# EAGLE design M302 (EAGLE 6.6.0)
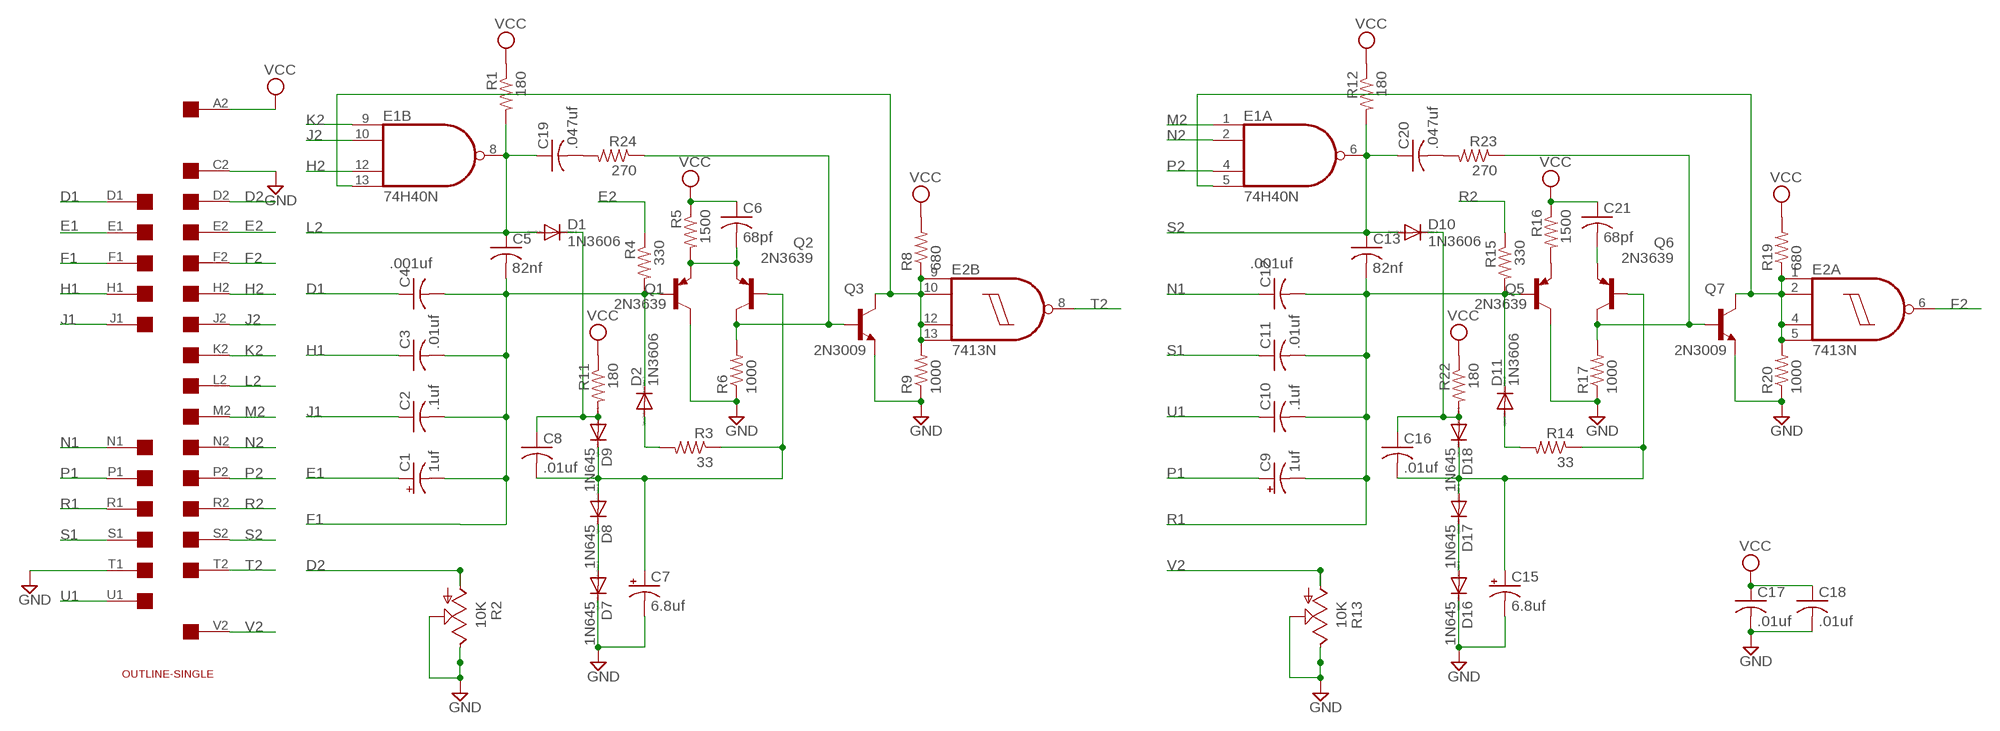
[diagram p0: schematic, sheet 1]

## Parts
C1  1uf  CPOL-USE15-5AXIAL  [E15-5]
C2  .1uf  C-US050-025X075  [C050-025X075]
C3  .01uf  C-US050-025X075  [C050-025X075]
C4  .001uf  C-US050-025X075  [C050-025X075]
C5  82nf  C-US050-025X075  [C050-025X075]
C6  68pf  C-US050-025X075  [C050-025X075]
C7  6.8uf  CPOL-USE15-5AXIAL  [E15-5]
C8  .01uf  C-US050-025X075  [C050-025X075]
C9  1uf  CPOL-USE15-5AXIAL  [E15-5]
C10  .1uf  C-US050-025X075  [C050-025X075]
C11  .01uf  C-US050-025X075  [C050-025X075]
C12  .001uf  C-US050-025X075  [C050-025X075]
C13  82nf  C-US050-025X075  [C050-025X075]
C15  6.8uf  CPOL-USE15-5AXIAL  [E15-5]
C16  .01uf  C-US050-025X075  [C050-025X075]
C17  .01uf  C-US050-025X075  [C050-025X075]
C18  .01uf  C-US050-025X075  [C050-025X075]
C19  .047uf  C-US050-025X075  [C050-025X075]
C20  .047uf  C-US050-025X075  [C050-025X075]
C21  68pf  C-US050-025X075  [C050-025X075]
D1  1N3606  1N4148DO35-10  [DO35-10]
D2  1N3606  1N4148DO35-10  [DO35-10]
D7  1N645  1N4148DO35-10  [DO35-10]
D8  1N645  1N4148DO35-10  [DO35-10]
D9  1N645  1N4148DO35-10  [DO35-10]
D10  1N3606  1N4148DO35-10  [DO35-10]
D11  1N3606  1N4148DO35-10  [DO35-10]
D16  1N645  1N4148DO35-10  [DO35-10]
D17  1N645  1N4148DO35-10  [DO35-10]
D18  1N645  1N4148DO35-10  [DO35-10]
E1  74H40N  74S20N  [DIL14]
E2  7413N  [DIL14]
Q1  2N3639  2N3637-PNP-TO39-EBC  [TO39]
Q2  2N3639  2N3637-PNP-TO39-EBC  [TO39]
Q3  2N3009  2N3019-NPN-TO39-EBC  [TO39]
Q5  2N3639  2N3637-PNP-TO39-EBC  [TO39]
Q6  2N3639  2N3637-PNP-TO39-EBC  [TO39]
Q7  2N3009  2N3019-NPN-TO39-EBC  [TO39]
R1  180  R-US_0207/10  [0207/10]
R2  10K  TRIM_US-PTSPIN  [PT-SPIN]
R3  33  R-US_0207/10  [0207/10]
R4  330  R-US_0207/10  [0207/10]
R5  1500  R-US_0207/10  [0207/10]
R6  1000  R-US_0207/10  [0207/10]
R8  680  R-US_0207/10  [0207/10]
R9  1000  R-US_0207/10  [0207/10]
R11  180  R-US_0207/10  [0207/10]
R12  180  R-US_0207/10  [0207/10]
R13  10K  TRIM_US-PTSPIN  [PT-SPIN]
R14  33  R-US_0207/10  [0207/10]
R15  330  R-US_0207/10  [0207/10]
R16  1500  R-US_0207/10  [0207/10]
R17  1000  R-US_0207/10  [0207/10]
R19  680  R-US_0207/10  [0207/10]
R20  1000  R-US_0207/10  [0207/10]
R22  180  R-US_0207/10  [0207/10]
R23  270  R-US_0207/10  [0207/10]
R24  270  R-US_0207/10  [0207/10]
U$1  SINGLE  [EDGE-CON2]
U$2  OUTLINE-SINGLE  [SINGLE]

## Nets
D1: C4.1 U$1.D1
D2: R2.A U$1.D2
E1: C1.+ U$1.E1
E2: R4.1 U$1.E2
F1: C1.- C2.2 C3.2 C4.2 C5.2 D2.C Q1.2(B) R4.2 U$1.F1
F2: E2.6(A:O) U$1.F2
GND [power]: C7.- C15.- C17.2 C18.2 D7.C D16.C Q1.3(C) Q3.1(E) Q5.3(C) Q7.1(E) R2.E R2.S R6.1 R9.1 R13.E R13.S R17.1 R20.1 U$1.C2 U$1.T1
H1: C3.1 U$1.H1
H2: E1.12(B:I2) U$1.H2
J1: C2.1 U$1.J1
J2: E1.10(B:I1) U$1.J2
K2: E1.9(B:I0) U$1.K2
L2: C5.1 C19.1 D1.A E1.8(B:O) R1.2 U$1.L2
M2: E1.1(A:I0) U$1.M2
N1: C12.1 U$1.N1
N2: E1.2(A:I1) U$1.N2
N$1: C8.1 D1.C D9.A R11.2
N$2: E1.13(B:I3) E2.9(B:I0) E2.10(B:I1) E2.12(B:I2) E2.13(B:I3) Q3.3(C) R8.1 R9.2
N$3: C6.2 Q1.1(E) Q2.1(E) R5.2
N$4: E1.5(A:I3) E2.1(A:I0) E2.2(A:I1) E2.4(A:I2) E2.5(A:I3) Q7.3(C) R19.1 R20.2
N$5: C7.+ C8.2 D8.A D9.C Q2.2(B) R3.1
N$6: Q6.3(C) Q7.2(B) R17.2 R23.1
N$7: D2.A R3.2
N$8: Q2.3(C) Q3.2(B) R6.2 R24.1
N$9: D7.A D8.C
N$10: Q5.1(E) R16.2
N$11: C21.2 Q6.1(E)
N$12: C15.+ C16.2 D17.A D18.C Q6.2(B) R14.1
N$13: D11.A R14.2
N$14: C19.2 R24.2
N$15: C20.2 R23.2
N$16: C16.1 D10.C D18.A R22.2
N$20: D16.A D17.C
P1: C9.+ U$1.P1
P2: E1.4(A:I2) U$1.P2
R1: C9.- C10.2 C11.2 C12.2 C13.2 D11.C Q5.2(B) R15.2 U$1.R1
R2: R15.1 U$1.R2
S1: C11.1 U$1.S1
S2: C13.1 C20.1 D10.A E1.6(A:O) R12.2 U$1.S2
T2: E2.8(B:O) U$1.T2
U1: C10.1 U$1.U1
V2: R13.A U$1.V2
VCC [power]: C6.1 C17.1 C18.1 C21.1 R1.1 R5.1 R8.2 R11.1 R12.1 R16.1 R19.2 R22.1 U$1.A2
Unconnected: U$1.A1 U$1.B1 U$1.B2 U$1.C1 U$1.K1 U$1.L1 U$1.M1 U$1.U2 U$1.V1

## Power pins joined to a net without a drawn wire
GND: E1.7(P:GND) E2.7(P:GND)
VCC: E1.14(P:VCC) E2.14(P:VCC)

## Library data of the parts
C1 C7 C9 C15 = rcl:CPOL-US: POLARIZED CAPACITOR, American symbol
C2-C6 C8 C10-C13 C16-C21 = rcl:C-US: CAPACITOR, American symbol
D1 D2 D7-D11 D16-D18 = diode:1N4148: DIODE high speed (Philips)
E1 = 74xx-us:74*20: Dual 4-input NAND gate
E2 = 74xx-us:74*13: Dual 4-input NAND schmitt trigger
Q1 Q2 Q5 Q6 = transistor:*-PNP-: PNP Transistror
Q3 Q7 = transistor:*-NPN-: NPN Transistror BF959 corrected 2008.03.06
R1 R3-R6 R8 R9 R11 R12 R14-R17 R19 R20 R22-R24 = rcl:R-US_: RESISTOR, American symbol
R2 R13 = pot:TRIM_US-: POTENTIOMETER
U$1 = dec-con:SINGLE: Single-Height DEC board
U$2 = dec-con:OUTLINE-*: Board outlines for DEC boards.

## Net classes
1 power: width 0.813 mm, clearance 0.508 mm

## Board
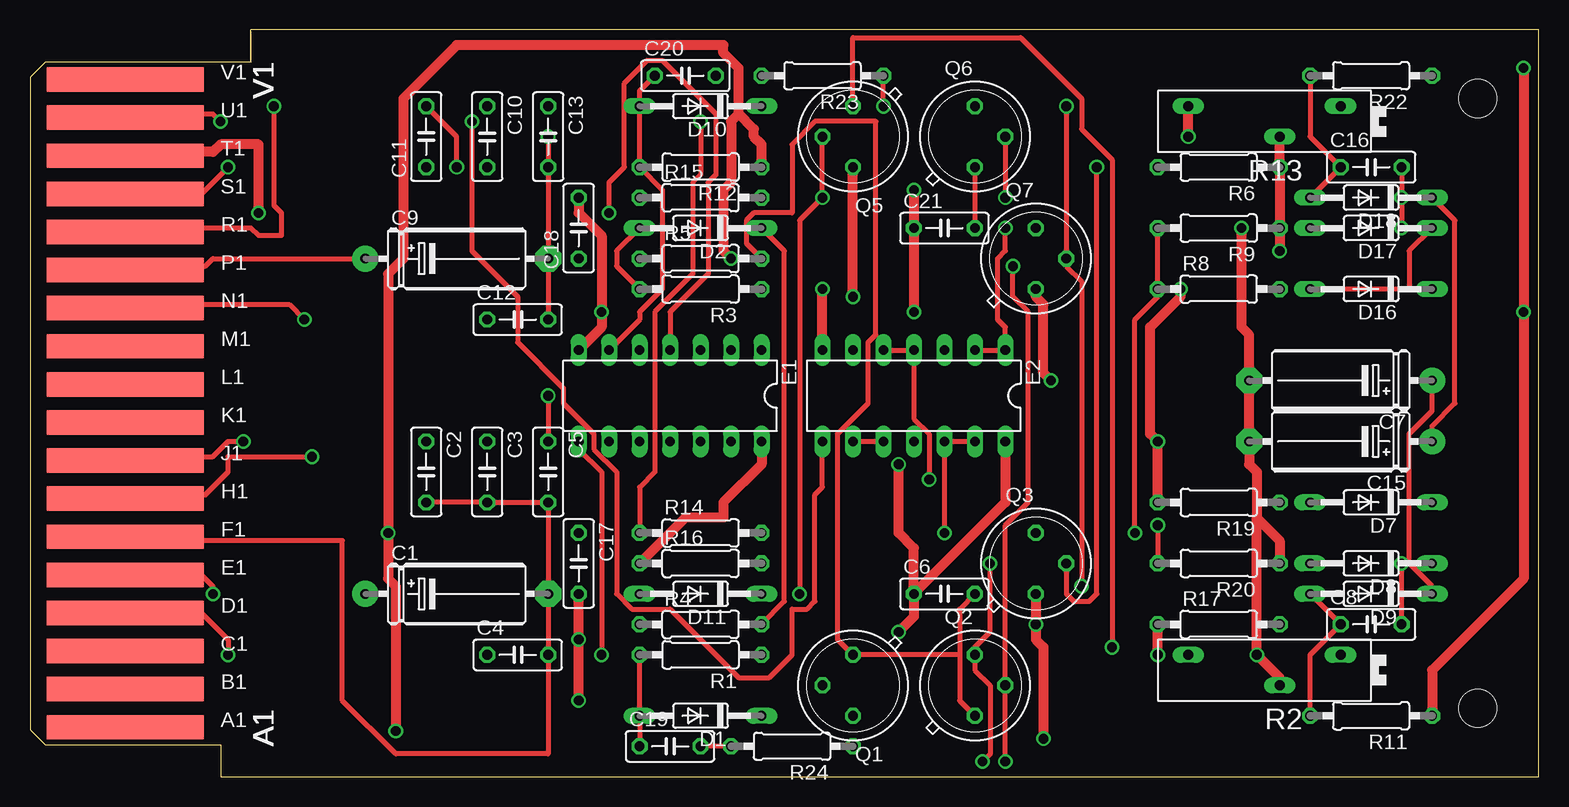
[diagram p1: board, top side]
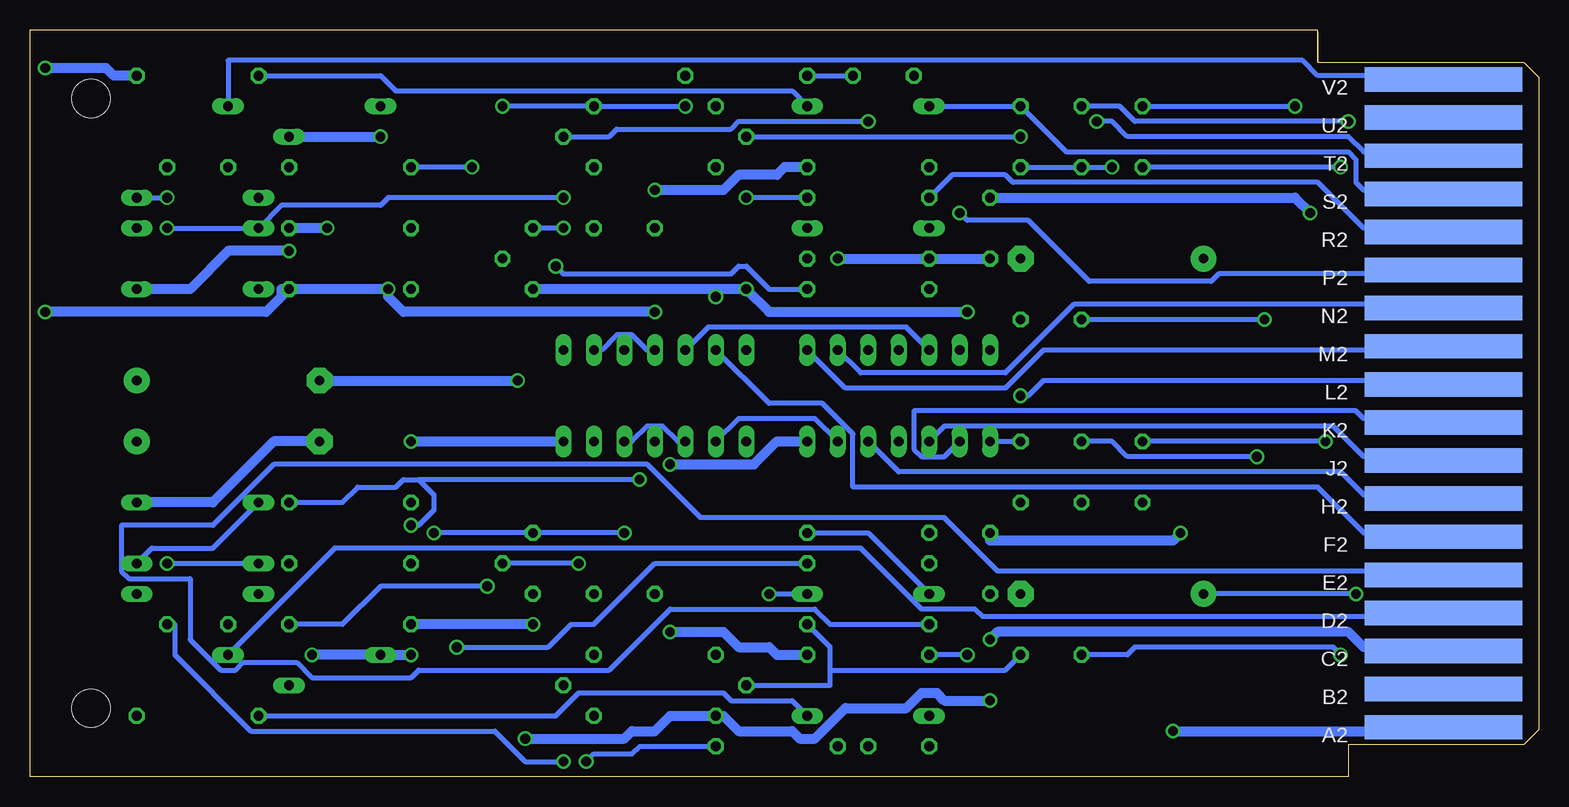
[diagram p2: board, bottom side, seen from below]

Size 125.73 x 62.23 mm. Coordinates in mm from the lower left corner, seen from the top.
Copper layers (1+16): Top 0.035mm / dielectric 1.5mm / Bottom 0.035mm
Design rules "16mils": minimum track width 16mil, minimum drill 32mil, track to track 15mil, track to pad 10mil, pad to pad 10mil, via to via 10mil, smd to smd 10mil, copper to edge 13mil, drill to drill 10mil, minimum pad ring 10mil, minimum via ring 8mil, stop-mask expansion 0mil, vias tented up to drill 0mil, thermal gap 10mil

### Footprints (pad centres in the part's own frame; a part is rotated, then mirrored left to right if it is on the bottom)
E15-5 = drill 0.813 pad 2.159: + -7.62,0 | drill 0.813 pad 2.159 octagon: - 7.62,0
C050-025X075 = drill 0.813 octagon: 1 -2.54,0; 2 2.54,0
DO35-10 = drill 0.813 long: A 5.08,0; C -5.08,0
DIL14 = drill 0.813 long: 1 -7.62,-3.81; 2 -5.08,-3.81; 3 -2.54,-3.81; 4 0,-3.81; 5 2.54,-3.81; 6 5.08,-3.81; 7 7.62,-3.81; 8 7.62,3.81; 9 5.08,3.81; 10 2.54,3.81; 11 0,3.81; 12 -2.54,3.81; 13 -5.08,3.81; 14 -7.62,3.81
TO39 = drill 0.813 octagon: 1 0,-2.54; 2 2.54,0; 3 0,2.54
0207/10 = drill 0.813 octagon: 1 -5.08,0; 2 5.08,0
PT-SPIN = drill 0.813 long: A -6.35,-1.27; E 6.35,-1.27; S -1.27,1.27
EDGE-CON2 = smd 13.106 x 2.032: A1 7.938,4.128; B1 7.938,7.303; C1 7.938,10.477; D1 7.938,13.652; E1 7.938,16.828; F1 7.938,20.003; H1 7.938,23.177; J1 7.938,26.352; K1 7.938,29.527; L1 7.938,32.703; M1 7.938,35.877; N1 7.938,39.053; P1 7.938,42.227; R1 7.938,45.403; S1 7.938,48.578; T1 7.938,51.752; U1 7.938,54.928; V1 7.938,58.102 | smd 13.106 x 2.032 bottom: A2 7.938,4.128; B2 7.938,7.303; C2 7.938,10.477; D2 7.938,13.652; E2 7.938,16.828; F2 7.938,20.003; H2 7.938,23.177; J2 7.938,26.352; K2 7.938,29.527; L2 7.938,32.703; M2 7.938,35.877; N2 7.938,39.053; P2 7.938,42.227; R2 7.938,45.403; S2 7.938,48.578; T2 7.938,51.752; U2 7.938,54.928; V2 7.938,58.102
SINGLE = hole 3.175: 120.65,56.515; 120.65,5.715

### Placement (x,y rotation side)
C1  35.56,15.24 0 top
C2  33.02,25.4 270 top
C3  38.1,25.4 270 top
C4  40.64,10.16 0 top
C5  43.18,25.4 270 top
C6  76.2,15.24 0 top
C7  109.22,33.02 180 top
C8  111.76,12.7 0 top
C9  35.56,43.18 0 top
C10  38.1,53.34 270 top
C11  33.02,53.34 90 top
C12  40.64,38.1 0 top
C13  43.18,53.34 270 top
C15  109.22,27.94 180 top
C16  111.76,50.8 0 top
C17  45.72,17.78 270 top
C18  45.72,45.72 90 top
C19  53.34,2.54 0 top
C20  54.61,58.42 0 top
C21  76.2,45.72 0 top
D1  55.88,5.08 180 top
D2  55.88,45.72 180 top
D7  111.76,22.86 180 top
D8  111.76,17.78 180 top
D9  111.76,15.24 180 top
D10  55.88,55.88 180 top
D11  55.88,15.24 180 top
D16  111.76,40.64 180 top
D17  111.76,45.72 180 top
D18  111.76,48.26 180 top
E1  53.34,31.75 180 top
E2  73.66,31.75 180 top
Q1  68.58,7.62 180 top
Q2  78.74,7.62 0 top
Q3  83.82,17.78 0 top
Q5  68.58,53.34 180 top
Q6  78.74,53.34 0 top
Q7  83.82,43.18 0 top
R1  55.88,10.16 180 top
R2  102.87,8.89 180 top
R3  55.88,40.64 180 top
R4  55.88,12.7 0 top
R5  55.88,43.18 0 top
R6  99.06,50.8 180 top
R8  99.06,40.64 0 top
R9  99.06,45.72 180 top
R11  111.76,5.08 180 top
R12  55.88,50.8 180 top
R13  102.87,54.61 180 top
R14  55.88,20.32 0 top
R15  55.88,48.26 0 top
R16  55.88,17.78 0 top
R17  99.06,12.7 0 top
R19  99.06,22.86 180 top
R20  99.06,17.78 180 top
R22  111.76,58.42 180 top
R23  66.04,58.42 180 top
R24  63.5,2.54 180 top
U$1  0,0 0 top
U$2  0,0 0 top

### Tracks (layer width: path | path; a pad name or v marks a point on that pad's centre or on a via)
D1  (via drill 0.81)
  Top 0.406: v16.51,10.16 16.51,11.43 13.97,13.97 8.26,13.97 U$1.D1
  Bottom 0.406: C4.1 34.29,10.16 33.66,10.79 17.15,10.79 v16.51,10.16
D2
  Bottom 0.406: R2.A 100.33,19.05 56.52,19.05 51.44,13.97 46.99,13.97 46.36,13.34 8.26,13.34 U$1.D2
E1  (via drill 0.81)
  Top 0.406: v15.24,15.24 15.24,15.88 13.97,17.14 8.26,17.14 U$1.E1
  Bottom 0.406: v15.24,15.24 C1.+
E2
  Bottom 0.406: R4.1 59.06,12.7 60.33,13.97 72.39,13.97 77.47,8.89 93.35,8.89 93.98,8.26 102.24,8.26 103.51,9.53 107.95,9.53 108.59,8.89 109.86,8.89 112.4,11.43 112.4,16.51 117.48,16.51 118.11,17.14 118.11,20.95 110.49,20.95 105.41,26.04 74.3,26.04 69.85,21.59 49.53,21.59 45.09,17.14 8.26,17.14 U$1.E2
F1
  Top 0.406: C2.2 C3.2 C5.2 C1.- C4.2 43.18,1.91 30.48,1.91 26.04,6.35 26.04,19.68 8.26,19.68 U$1.F1 | D2.C 62.87,43.81 62.87,14.61 R4.2
  Bottom 0.406: R4.2 59.06,10.79 59.06,8.89 | 59.06,8.89 59.06,7.62 Q1.2 | C4.2 44.45,8.89 59.06,8.89
F2
  Bottom 0.406: E2.6 64.14,31.11 59.69,31.11 57.15,28.57 57.15,24.13 18.42,24.13 14.61,20.32 8.26,20.32 U$1.F2
GND  (via drill 0.81)
  Top 0.813: E1.7 47.63,37.47 v47.63,38.73 47.63,45.09 45.72,46.99 C18.2 | E2.7 v66.04,40.64 | v68.58,40.01 Q5.3 | v19.05,46.99 19.05,52.7 15.88,52.7 15.24,52.07 8.26,52.07 U$1.T1 | C17.2 v45.72,11.43 v45.72,6.35 | v104.14,43.81 R9.1 R6.1 R13.S | v96.52,53.34 R13.E | R20.1 104.14,19.68 102.24,21.59 | 102.24,21.59 102.24,25.4 101.6,26.04 C15.- C7.- 101.6,36.83 100.97,37.47 v100.97,45.72 | v93.98,10.16 R17.1 | R2.S 104.14,8.26 v102.24,10.16 102.24,21.59 | v84.46,3.17 84.46,10.79 83.82,11.43 v83.82,12.7 Q3.1 | Q7.1 83.82,40.01 84.46,39.37 84.46,33.66 v85.09,33.02
  Bottom 0.813: 68.58,40.64 v66.04,40.64 64.14,38.73 v47.63,38.73 | 68.58,40.64 Q7.1 | 68.58,40.64 v68.58,40.01 | v19.05,46.99 20.32,48.26 C18.2 | v45.72,11.43 45.09,12.06 15.88,12.06 14.61,10.79 8.26,10.79 U$1.C2 | D16.C 112.4,40.64 109.22,43.81 v104.14,43.81 | R13.S v96.52,53.34 | D7.C 110.49,22.86 105.41,27.94 C15.- | v93.98,10.16 R2.E v102.24,10.16 | v84.46,3.17 76.2,3.17 75.57,3.81 73.66,3.81 72.39,5.08 Q1.3 67.95,5.08 66.68,3.81 62.23,3.81 61.6,3.17 60.33,3.17 57.79,5.71 52.71,5.71 51.44,6.99 50.17,6.99 49.53,6.35 v45.72,6.35 | v83.82,12.7 R17.1 | v100.97,45.72 R9.1 | C7.- v85.09,33.02
H1  (via drill 0.81)
  Top 0.406: v23.5,26.67 16.51,26.67 16.51,25.4 14.61,23.5 8.26,23.5 U$1.H1
  Bottom 0.406: C3.1 35.56,27.94 34.29,26.67 v23.5,26.67
H2
  Bottom 0.406: E1.12 53.34,25.4 16.51,25.4 14.61,23.5 8.26,23.5 U$1.H2
J1  (via drill 0.81)
  Top 0.406: v17.78,27.94 16.51,27.94 15.24,26.67 8.26,26.67 U$1.J1
  Bottom 0.406: v17.78,27.94 C2.1
J2
  Bottom 0.406: E1.10 49.53,29.21 17.15,29.21 14.61,26.67 8.26,26.67 U$1.J2
K2
  Bottom 0.406: E1.9 49.53,26.67 51.44,26.67 52.07,27.3 52.07,30.48 15.24,30.48 14.61,29.84 8.26,29.84 U$1.K2
L2  (via drill 0.81)
  Top 0.406: C19.1 D1.A R1.2 | v43.18,31.75 C5.1 | v47.63,10.16 47.63,25.4 45.72,27.3 E1.8
  Bottom 0.406: E1.8 C5.1 | v43.18,31.75 42.55,31.75 41.28,33.02 8.26,33.02 U$1.L2 | v47.63,10.16 R1.2
M2
  Bottom 0.406: E1.1 57.79,32.38 44.45,32.38 41.28,35.56 8.26,35.56 U$1.M2
N1  (via drill 0.81)
  Top 0.406: v22.86,38.1 21.59,39.37 8.26,39.37 U$1.N1
  Bottom 0.406: v22.86,38.1 C12.1
N2
  Bottom 0.406: E1.2 56.52,33.66 44.45,33.66 38.74,39.37 8.26,39.37 U$1.N2
N$1
  Top 0.406: D9.A C8.1 106.68,10.16 R11.2
  Bottom 0.406: D1.C 62.23,6.35 67.31,6.35 67.95,6.99 80.01,6.99 81.92,5.08 R11.2
N$2  (via drill 0.81)
  Top 0.406: R9.2 R8.1 93.98,40.01 92.08,38.1 v92.08,20.32 | E2.9 E2.10 | E2.13 E2.12 v76.2,20.32
  Bottom 0.406: E2.9 66.68,29.84 60.33,29.84 E1.13 | E2.12 75.57,27.94 74.3,29.21 73.03,29.21 71.76,27.94 E2.10 | v76.2,20.32 Q3.3 v92.08,20.32
N$3
  Top 0.406: 77.47,10.16 Q1.1 67.31,11.43 67.31,28.57 69.85,31.11 69.85,36.2 70.49,36.83 70.49,54.61 65.41,54.61 63.5,52.7 63.5,46.99 60.33,46.99 59.69,46.35 59.69,44.45 R5.2 | 77.47,10.16 77.47,13.97 C6.2 | Q2.1 77.47,6.35 77.47,10.16
N$4  (via drill 0.81)
  Top 0.406: v93.98,20.95 R20.2 | E2.5 E2.4 73.66,29.84 74.93,28.57 v74.93,24.77 | E2.2 E2.1 81.28,37.47 80.65,38.1 80.65,43.18 81.28,43.81 v81.28,45.72
  Bottom 0.406: v93.98,20.95 93.35,20.95 92.08,22.23 92.08,23.5 93.35,24.77 | 93.35,24.77 94.62,24.77 95.25,24.13 98.43,24.13 99.7,22.86 R19.1 | E2.5 69.22,37.47 52.71,37.47 E1.5 | E2.2 78.11,35.56 76.84,36.83 75.57,36.83 74.3,35.56 E2.4 | v81.28,45.72 Q7.3 | v74.93,24.77 93.35,24.77
N$5  (via drill 0.81)
  Top 0.406: C7.+ 116.84,30.48 114.94,28.57 114.94,17.78 | 114.94,17.78 116.84,15.88 D9.C | v81.28,1.27 Q2.2 81.28,20.95 83.19,22.86 83.19,38.73 81.92,40.01 v81.92,42.55 | C8.2 v114.3,17.78 114.94,17.78
  Bottom 0.406: v81.28,1.27 84.46,1.27 87,3.81 107.32,3.81 113.67,10.16 113.67,12.7 C8.2 | R3.1 64.14,40.64 66.04,42.55 66.68,42.55 67.31,41.91 81.28,41.91 v81.92,42.55 | v114.3,17.78 D8.A
N$6  (via drill 0.81)
  Top 0.406: v86.36,55.88 Q7.2 86.36,42.55 87.63,41.27 v87.63,15.88 | v71.12,55.88 R23.1
  Bottom 0.406: v86.36,55.88 Q6.3 v71.12,55.88 | R17.2 99.7,12.7 96.52,15.88 v87.63,15.88
N$7
  Top 0.406: R3.2 48.9,42.55 48.9,43.81 D2.A
N$8  (via drill 0.81)
  Top 0.406: v79.38,1.27 80.01,1.91 80.01,7.62 78.74,8.89 Q2.3 78.74,10.79 80.01,12.06 v80.01,17.78 | v88.9,50.8 88.9,15.24 88.27,14.61 87,14.61 86.36,15.24 Q3.2
  Bottom 0.406: R24.1 74.93,2.54 75.57,1.91 78.74,1.91 v79.38,1.27 | v80.01,17.78 Q3.2 | v88.9,50.8 R6.2
N$9
  Bottom 0.406: D7.A 110.49,19.05 115.57,19.05 D8.C
N$10  (via drill 0.81)
  Top 0.406: v90.17,10.79 90.17,51.44 87.63,53.98 87.63,56.52 82.55,61.59 68.58,61.59 Q5.1
  Bottom 0.406: R16.2 73.66,17.78 78.74,12.7 80.65,12.7 82.55,10.79 v90.17,10.79
N$11
  Top 0.406: Q6.1 C21.2
N$12  (via drill 0.81)
  Top 0.406: C16.2 v114.3,48.26 v114.3,45.72 | D18.C 118.75,46.35 118.75,31.11 116.84,29.21 C15.+ | R14.1 50.8,24.13 52.07,25.4 52.07,38.73 55.25,41.91 55.25,49.53 55.88,50.16 v55.88,54.61 | Q6.2 v81.28,48.26
  Bottom 0.406: v114.3,45.72 D17.A 104.78,47.62 96.52,47.62 95.89,48.26 v81.28,48.26 | D18.C v114.3,48.26 | v55.88,54.61 66.68,54.61 67.31,53.98 76.84,53.98 77.47,53.34 Q6.2
N$13
  Bottom 0.406: D11.A 55.88,20.32 R14.2
N$14
  Top 0.406: R24.2 C19.2
N$15
  Bottom 0.406: R23.2 C20.2
N$16
  Top 0.406: D18.A C16.1 106.68,53.34 R22.2
  Bottom 0.406: D10.C 62.23,57.15 95.25,57.15 96.52,58.42 R22.2
N$20
  Top 0.406: D16.A 114.94,40.64 114.94,43.81 D17.C
P1
  Top 0.406: C9.+ 15.24,43.18 14.61,42.55 8.26,42.55 U$1.P1
P2  (via drill 0.81)
  Top 0.406: E1.4 53.34,38.73 56.52,41.91 56.52,49.53 57.15,50.16 57.15,55.24 52.71,59.69 51.44,59.69 49.53,57.78 49.53,50.8 48.26,49.53 v48.26,46.99
  Bottom 0.406: v48.26,46.99 47.63,46.35 42.55,46.35 37.47,41.27 27.31,41.27 26.67,41.91 12.07,41.91 11.43,42.55 8.26,42.55 U$1.P2
R1  (via drill 0.81)
  Top 0.406: C12.2 C9.- C13.2 v43.18,53.34 | C11.2 35.56,53.34 v35.56,50.8 | Q5.2 v66.04,48.26 64.14,46.35 v64.14,15.24 | v20.32,55.88 20.32,47.62 20.96,46.99 20.96,45.09 19.05,45.09 18.42,45.72 8.26,45.72 U$1.R1
  Bottom 0.406: C13.2 C10.2 v35.56,50.8 | R15.2 v66.04,48.26 | v64.14,15.24 D11.C | Q5.2 v43.18,53.34 | C11.2 v20.32,55.88
R2
  Bottom 0.406: R15.1 48.9,50.16 44.45,50.16 43.82,49.53 18.42,49.53 14.61,45.72 8.26,45.72 U$1.R2
S1  (via drill 0.81)
  Top 0.406: v16.51,50.8 13.97,48.26 11.43,48.26 10.8,48.9 8.26,48.9 U$1.S1
  Bottom 0.406: v16.51,50.8 C11.1
S2
  Top 0.406: C20.1 50.8,57.15 D10.A R12.2 52.71,48.9 52.71,40.64 50.8,38.73 50.8,38.1 E1.6
  Bottom 0.406: D10.A C13.1 39.37,52.07 15.88,52.07 15.24,51.44 15.24,49.53 14.61,48.9 8.26,48.9 U$1.S2
T2  (via drill 0.81)
  Top 0.406: E2.8 66.04,24.13 65.41,23.5 65.41,14.61 64.77,13.97 63.5,13.97 63.5,10.16 61.6,8.26 59.06,8.26 53.34,13.97 50.17,13.97 48.9,15.24 48.9,25.4 46.99,27.3 46.99,28.57 44.45,31.11 44.45,32.38 40.64,36.2 40.64,40.01 36.83,43.81 v36.83,54.61
  Bottom 0.406: v36.83,54.61 35.56,54.61 34.29,53.34 15.88,53.34 14.61,52.07 8.26,52.07 U$1.T2
U1  (via drill 0.81)
  Top 0.406: v15.88,54.61 15.24,55.24 8.26,55.24 U$1.U1
  Bottom 0.406: C10.1 34.93,55.88 33.66,54.61 v15.88,54.61
V2
  Bottom 0.406: R13.A 109.22,59.69 19.69,59.69 18.42,58.42 8.26,58.42 U$1.V2
VCC  (via drill 0.81)
  Top 0.813: R11.1 116.84,8.89 124.46,16.51 v124.46,38.73 v124.46,59.05 | R16.1 54.61,21.59 57.79,21.59 57.79,22.86 60.96,26.04 E1.14 | v72.39,12.06 73.66,13.34 C6.1 | R19.2 v93.98,27.94 93.35,28.57 93.35,37.47 95.89,40.01 v95.89,40.64 | C6.1 81.28,22.86 E2.14 | v72.39,26.04 72.39,20.32 73.66,19.05 C6.1 | 59.06,55.24 59.06,59.05 57.79,60.33 57.79,60.96 35.56,60.96 31.12,56.52 31.12,43.18 29.85,41.91 v29.85,20.32 29.85,16.51 30.48,15.88 v30.48,3.81 | 59.06,55.24 60.33,53.98 60.33,53.34 60.96,52.7 R12.1 | v73.66,48.9 C21.1 v73.66,38.73 | v58.42,43.18 57.79,43.81 57.79,48.9 58.42,49.53 58.42,54.61 59.06,55.24
  Bottom 0.813: v124.46,59.05 119.38,59.05 118.75,58.42 R22.1 | R1.1 63.5,10.16 64.14,10.79 66.68,10.79 67.95,12.06 v72.39,12.06 | v93.98,27.94 E2.14 | E1.14 63.5,27.94 65.41,26.04 v72.39,26.04 | v124.46,38.73 106.05,38.73 104.78,40.01 104.78,40.64 R8.2 v95.89,40.64 95.89,40.01 94.62,38.73 v73.66,38.73 | C18.1 R5.1 v58.42,43.18 | C17.1 45.72,19.68 30.48,19.68 v29.85,20.32 | v73.66,48.9 67.95,48.9 66.68,50.16 63.5,50.16 62.87,50.8 R12.1 | v30.48,3.81 8.26,3.81 U$1.A2

### Text on the board
tNames: V1 | V1 | V1 | V1 | V1 | V1 | V1 | V1 | V1 | V1 | V1 | V1 | V1 | V1 | V1 | V1 | V1 | V1 | V1 | V1 | V1 | V1 | V1 | V1 | V1 | V1 | V1 | V1 | V1 | V1 | V1 | V1 | A1 | A1 | A1 | A1 | A1 | A1 | A1 | A1 | A1 | A1 | A1 | A1 | A1 | A1 | A1 | A1 | A1 | A1 | A1 | A1 | A1 | A1 | A1 | A1 | A1 | A1 | A1 | A1 | A1 | A1 | A1 | A1